# EAGLE schematic PolyDAC2 (EAGLE 5.11)

## Sheet 1 of 8
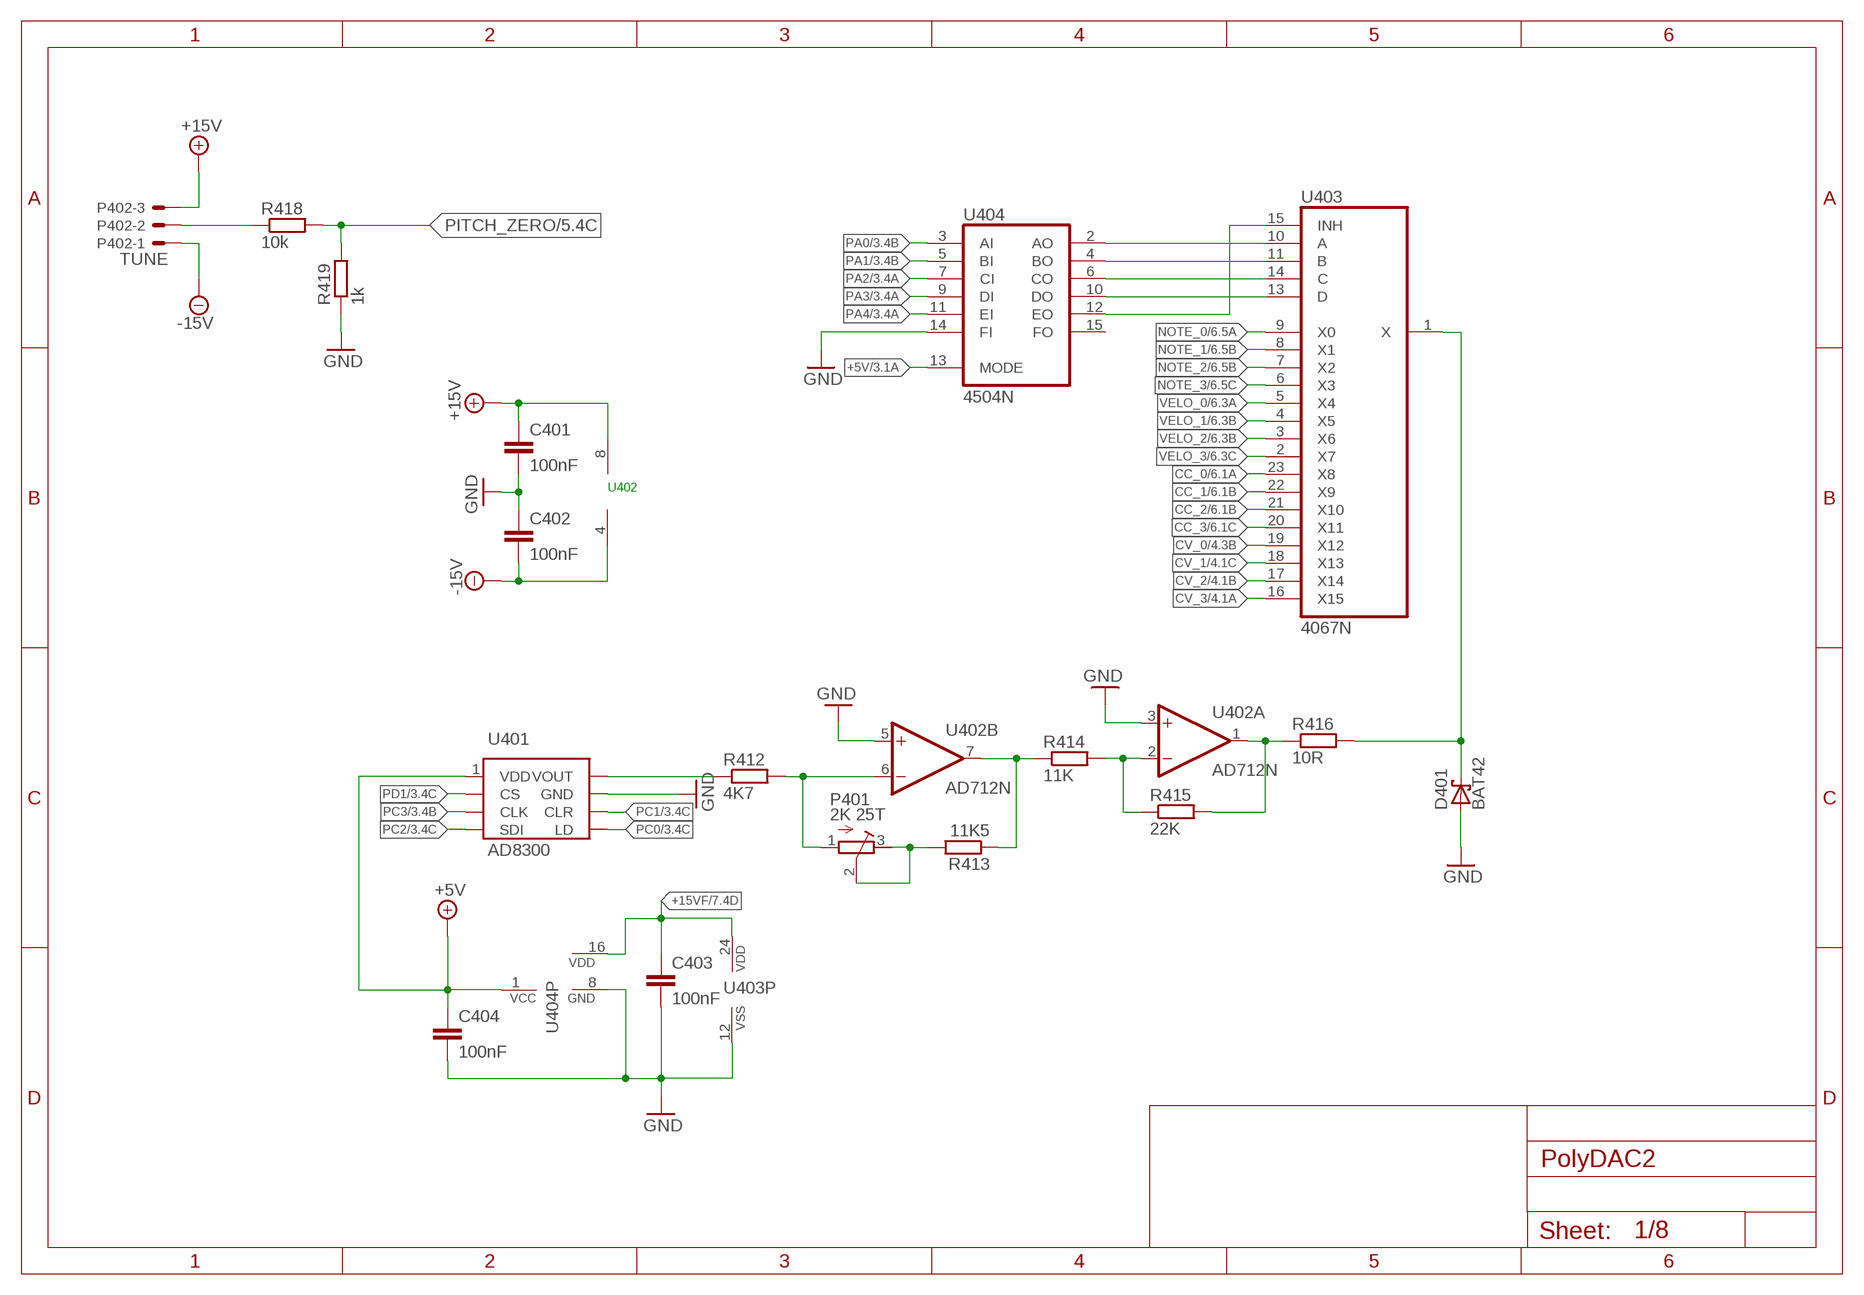
[diagram p0: schematic, sheet 1]

### Parts
C401  100nF  C-EU025-025X050  [C025-025X050]
C402  100nF  C-EU025-025X050  [C025-025X050]
C403  100nF  C-EU025-025X050  [C025-025X050]
C404  100nF  C-EU025-025X050  [C025-025X050]
D401  BAT42  [DO35-10]
P401  2K 25T  R-TRIMM64Y  [RTRIM64Y]
P402  TUNE  22-23-2031  [22-23-2031]
R412  4K7  R-EU_0207/10  [0207/10]
R413  11K5  R-EU_0207/10  [0207/10]
R414  11K  R-EU_0207/10  [0207/10]
R415  22K  R-EU_0207/10  [0207/10]
R416  10R  R-EU_0207/10  [0207/10]
R418  10k  R-EU_0207/10  [0207/10]
R419  1k  R-EU_0207/10  [0207/10]
U401  AD8300  [DIL08]
U402  AD712N  [DIL08]
U403  4067N  [DIL24-6]
U404  4504N  [DIL16]

### Nets
+5V [bold]: C404.1 U401.1(VDD) U404.1(VCC) U404.13(MODE) ; also sheet 2,3,7,8
+15V [bold]: C401.1 P402.3 U402.8(P:V+) ; also sheet 4,5,6,7,8
+15VF [bold]: C403.1 U403.24(VDD) U404.16(VDD) ; also sheet 7
-15V: C402.2 P402.1 U402.4(P:V-) ; also sheet 4,5,6,7
CC_0: U403.23(X8) ; also sheet 6
CC_1: U403.22(X9) ; also sheet 6
CC_2: U403.21(X10) ; also sheet 6
CC_3: U403.20(X11) ; also sheet 6
CV_0: U403.19(X12) ; also sheet 4
CV_1: U403.18(X13) ; also sheet 4
CV_2: U403.17(X14) ; also sheet 4
CV_3: U403.16(X15) ; also sheet 4
GND [bold]: C401.2 C402.1 C403.2 C404.2 D401.A R419.1 U401.7(GND) U402.3(A:+IN) U402.5(B:+IN) U403.12(VSS) U404.8(GND) U404.14(FI) ; also sheet 2,3,4,5,6,7,8
N$1: P402.2 R418.1
N$2: U403.10(A) U404.2(AO)
N$3: U403.11(B) U404.4(BO)
N$4: U403.14(C) U404.6(CO)
N$5: U403.13(D) U404.10(DO)
N$6: U403.15(INH) U404.12(EO)
N$7: D401.C R416.2 U403.1(X)
N$10: R415.2 R416.1 U402.1(A:OUT)
N$12: R412.1 U401.8(VOUT)
N$13: R414.2 R415.1 U402.2(A:-IN)
N$14: R413.1 R414.1 U402.7(B:OUT)
N$15: P401.2(S) P401.3(A) R413.2
N$17: P401.1(E) R412.2 U402.6(B:-IN)
NOTE_0: U403.9(X0) ; also sheet 6
NOTE_1: U403.8(X1) ; also sheet 6
NOTE_2: U403.7(X2) ; also sheet 6
NOTE_3: U403.6(X3) ; also sheet 6
PA0: U404.3(AI) ; also sheet 3
PA1: U404.5(BI) ; also sheet 3
PA2: U404.7(CI) ; also sheet 3
PA3: U404.9(DI) ; also sheet 3
PA4: U404.11(EI) ; also sheet 3
PC0: U401.5(LD) ; also sheet 3
PC1: U401.6(CLR) ; also sheet 3
PC2: U401.4(SDI) ; also sheet 3
PC3: U401.3(CLK) ; also sheet 3
PD1: U401.2(CS) ; also sheet 3
PITCH_ZERO: R418.2 R419.2 ; also sheet 5
VELO_0: U403.5(X4) ; also sheet 6
VELO_1: U403.4(X5) ; also sheet 6
VELO_2: U403.3(X6) ; also sheet 6
VELO_3: U403.2(X7) ; also sheet 6
Unconnected: U404.15(FO)

### Notes on the sheet
- U402

## Sheet 2 of 8
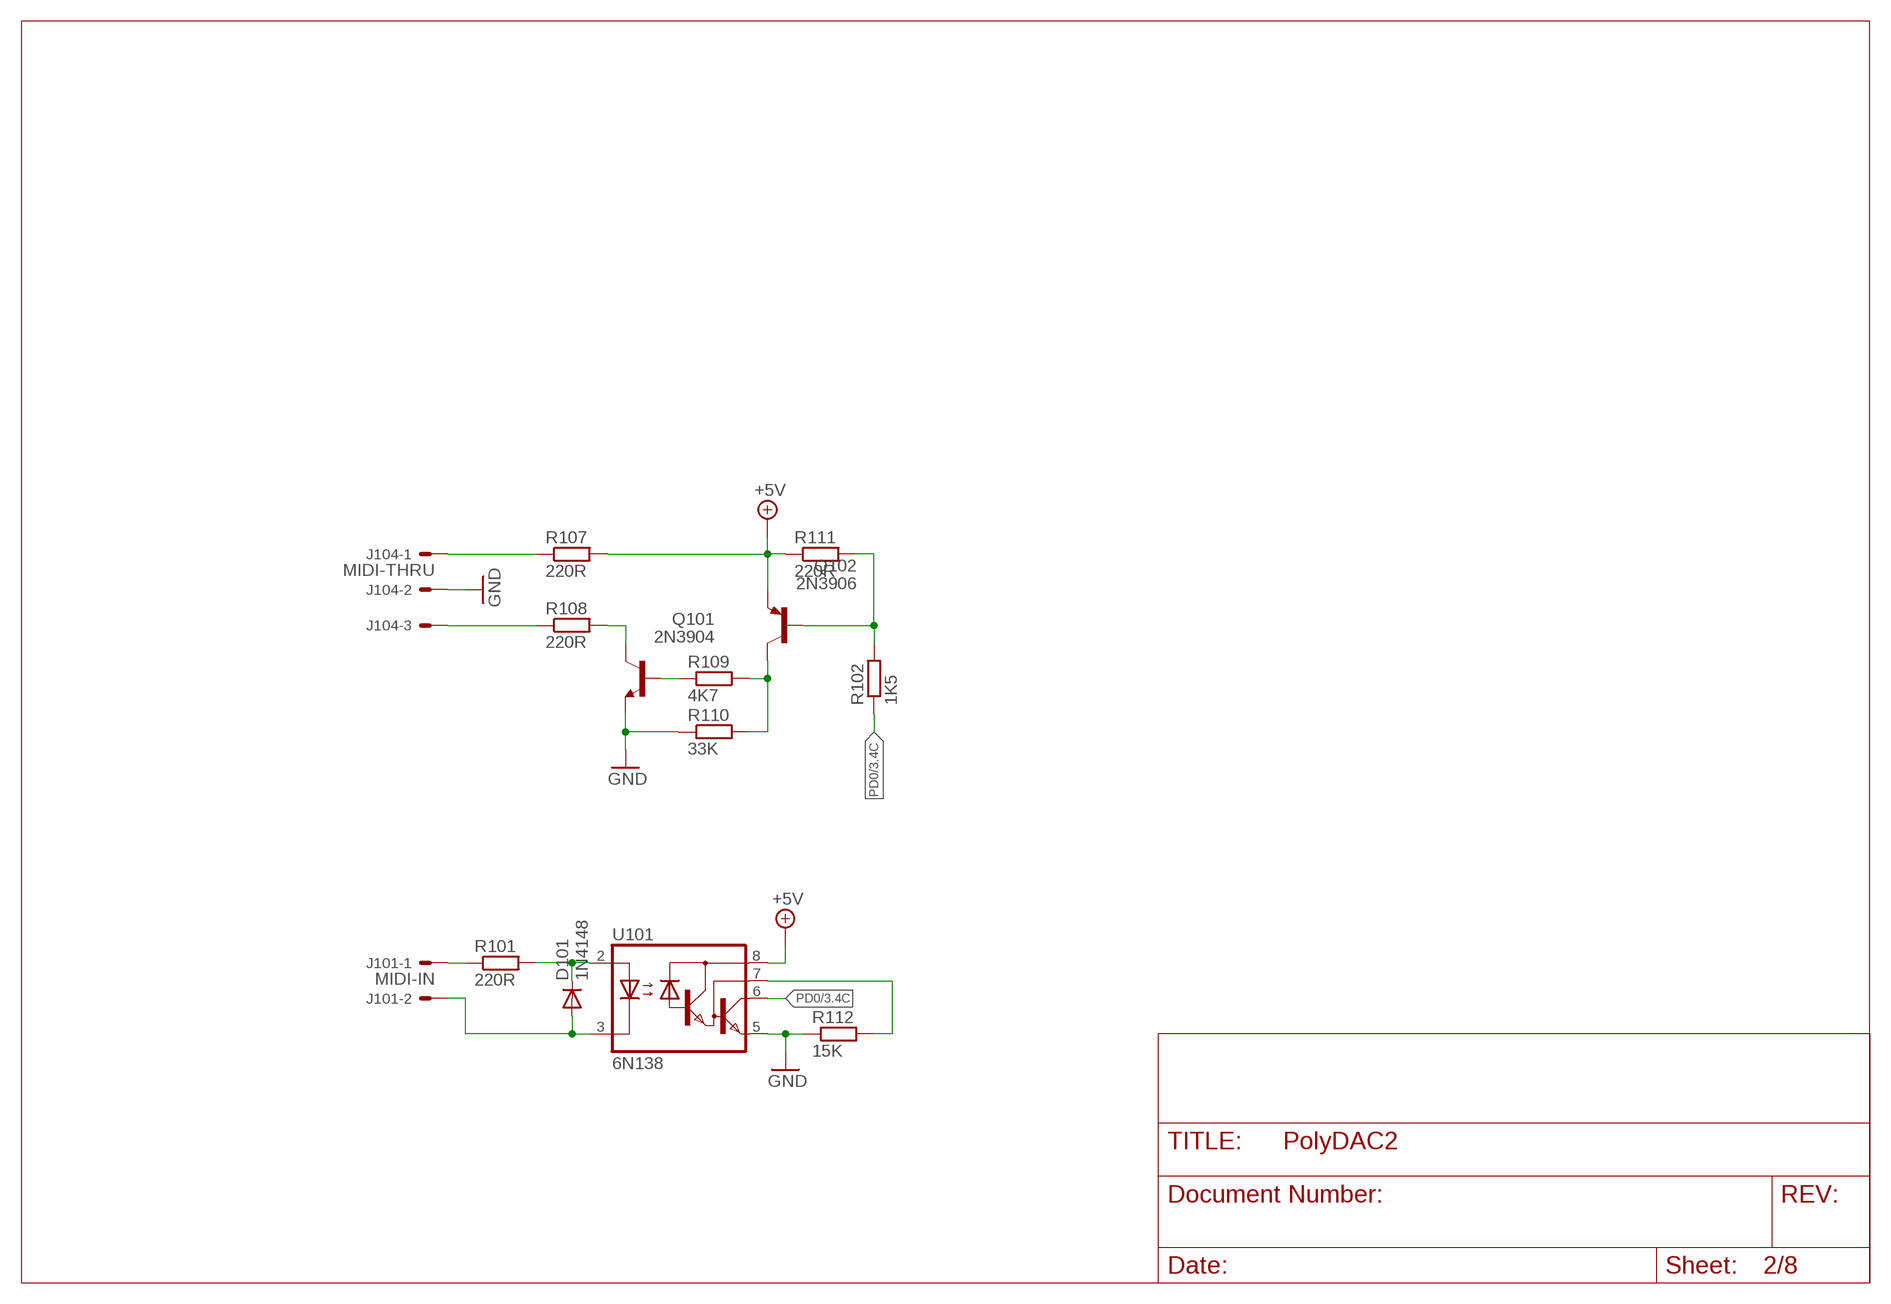
[diagram p1: schematic, sheet 2]

### Parts
D101  1N4148  1N4148DO35-10  [DO35-10]
J101  MIDI-IN  22-23-2021  [22-23-2021]
J104  MIDI-THRU  22-23-2031  [22-23-2031]
Q101  2N3904  [TO92]
Q102  2N3906  2N3906-PNP-TO92-EBC  [TO92-EBC]
R101  220R  R-EU_0207/10  [0207/10]
R102  1K5  R-EU_0207/10  [0207/10]
R107  220R  R-EU_0207/10  [0207/10]
R108  220R  R-EU_0207/10  [0207/10]
R109  4K7  R-EU_0207/10  [0207/10]
R110  33K  R-EU_0207/10  [0207/10]
R111  220R  R-EU_0207/10  [0207/10]
R112  15K  R-EU_0207/10  [0207/10]
U101  6N138  [DIL08]

### Nets
+5V [bold]: Q102.E R107.2 R111.1 U101.8(VCC) ; also sheet 1,3,7,8
GND [bold]: J104.2 Q101.3(E) R110.1 R112.1 U101.5(GND) ; also sheet 1,3,4,5,6,7,8
N$16: J104.1 R107.1
N$19: J104.3 R108.1
N$20: Q101.1(C) R108.2
N$21: Q101.2(B) R109.1
N$22: Q102.C R109.2 R110.2
N$24: D101.C R101.2 U101.2(A)
N$25: Q102.B R102.2 R111.2
N$26: J101.1 R101.1
N$27: D101.A J101.2 U101.3(C)
N$30: R112.2 U101.7(VB)
PD0: R102.1 U101.6(VO) ; also sheet 3

## Sheet 3 of 8
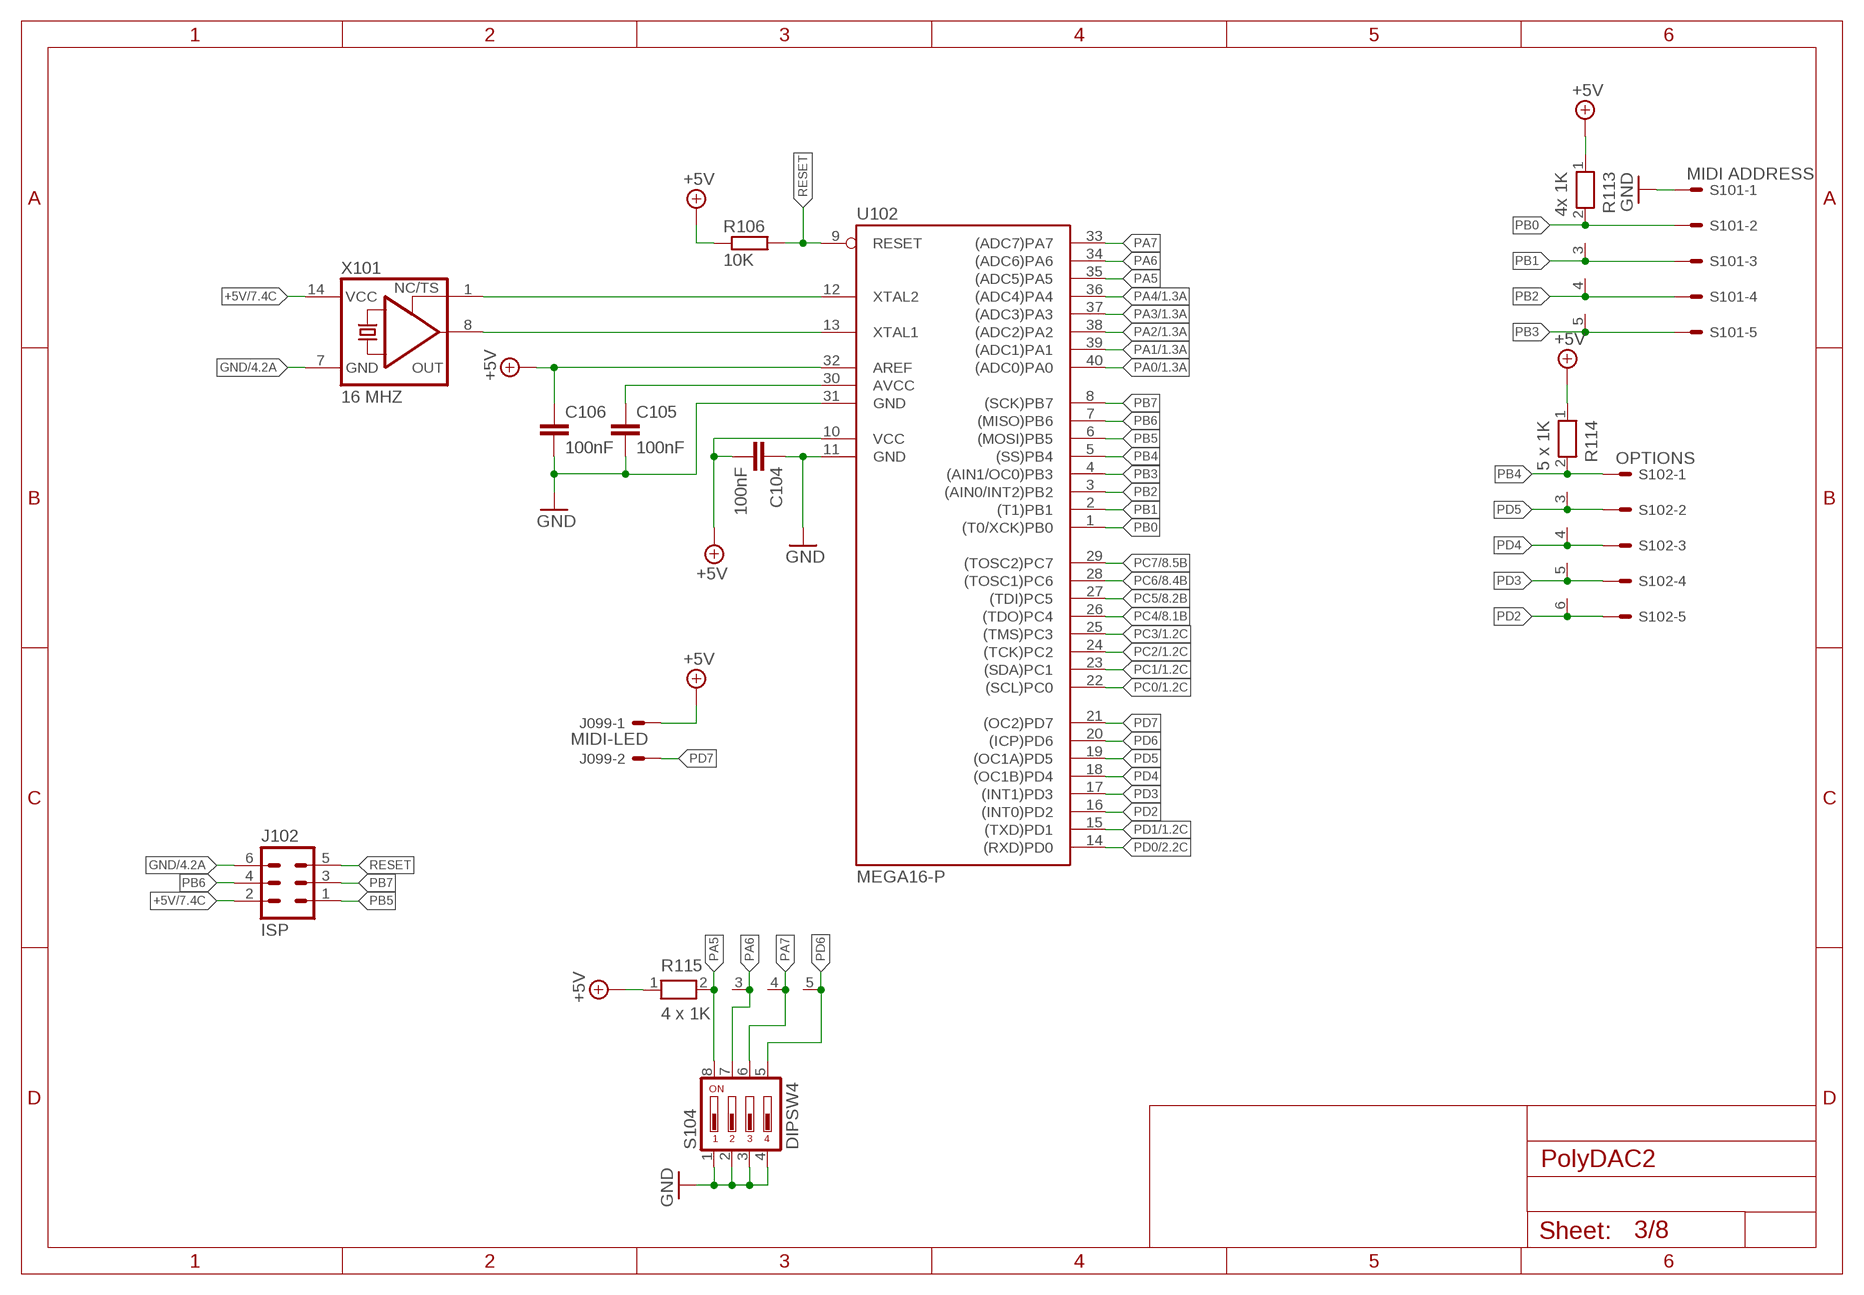
[diagram p2: schematic, sheet 3]

### Parts
C104  100nF  C-EU025-025X050  [C025-025X050]
C105  100nF  C-EU025-025X050  [C025-025X050]
C106  100nF  C-EU025-025X050  [C025-025X050]
J099  MIDI-LED  22-23-2021  [22-23-2021]
J102  ISP  ML6  [ML6]
R106  10K  R-EU_0207/10  [0207/10]
R113  4x 1K  RN04  [RN-5]
R114  5 x 1K  RN05  [RN-6]
R115  4 x 1K  RN04  [RN-5]
S101  MIDI ADDRESS  22-23-2051  [22-23-2051]
S102  OPTIONS  22-23-2051  [22-23-2051]
S104  DIPSW4  DP04  [DP-04]
U102  MEGA16-P  [DIL40]
X101  16 MHZ  XO-14  [DIL14S]

### Nets
+5V [bold]: C104.2 C106.1 J099.1 J102.2 R106.1 R113.1 R114.1 R115.1 U102.10(VCC) U102.32(AREF) X101.14(VCC) ; also sheet 1,2,7,8
GND [bold]: C104.1 C105.2 C106.2 J102.6 S101.1 S104.1 S104.2 S104.3 S104.4 U102.11(GND) U102.31(GND) X101.7(GND) ; also sheet 1,2,4,5,6,7,8
N$28: U102.13(XTAL1) X101.8(OUT)
N$29: U102.12(XTAL2) X101.1(TS)
N$32: C105.1 U102.30(AVCC)
PA0: U102.40((ADC0)PA0) ; also sheet 1
PA1: U102.39((ADC1)PA1) ; also sheet 1
PA2: U102.38((ADC2)PA2) ; also sheet 1
PA3: U102.37((ADC3)PA3) ; also sheet 1
PA4: U102.36((ADC4)PA4) ; also sheet 1
PA5: R115.2 S104.8 U102.35((ADC5)PA5)
PA6: R115.3 S104.7 U102.34((ADC6)PA6)
PA7: R115.4 S104.6 U102.33((ADC7)PA7)
PB0: R113.2 S101.2 U102.1((T0/XCK)PB0)
PB1: R113.3 S101.3 U102.2((T1)PB1)
PB2: R113.4 S101.4 U102.3((AIN0/INT2)PB2)
PB3: R113.5 S101.5 U102.4((AIN1/OC0)PB3)
PB4: R114.2 S102.1 U102.5((SS)PB4)
PB5: J102.1 U102.6((MOSI)PB5)
PB6: J102.4 U102.7((MISO)PB6)
PB7: J102.3 U102.8((SCK)PB7)
PC0: U102.22((SCL)PC0) ; also sheet 1
PC1: U102.23((SDA)PC1) ; also sheet 1
PC2: U102.24((TCK)PC2) ; also sheet 1
PC3: U102.25((TMS)PC3) ; also sheet 1
PC4: U102.26((TDO)PC4) ; also sheet 8
PC5: U102.27((TDI)PC5) ; also sheet 8
PC6: U102.28((TOSC1)PC6) ; also sheet 8
PC7: U102.29((TOSC2)PC7) ; also sheet 8
PD0: U102.14((RXD)PD0) ; also sheet 2
PD1: U102.15((TXD)PD1) ; also sheet 1
PD2: R114.6 S102.5 U102.16((INT0)PD2)
PD3: R114.5 S102.4 U102.17((INT1)PD3)
PD4: R114.4 S102.3 U102.18((OC1B)PD4)
PD5: R114.3 S102.2 U102.19((OC1A)PD5)
PD6: R115.5 S104.5 U102.20((ICP)PD6)
PD7: J099.2 U102.21((OC2)PD7)
RESET: J102.5 R106.2 U102.9(RESET)

## Sheet 4 of 8
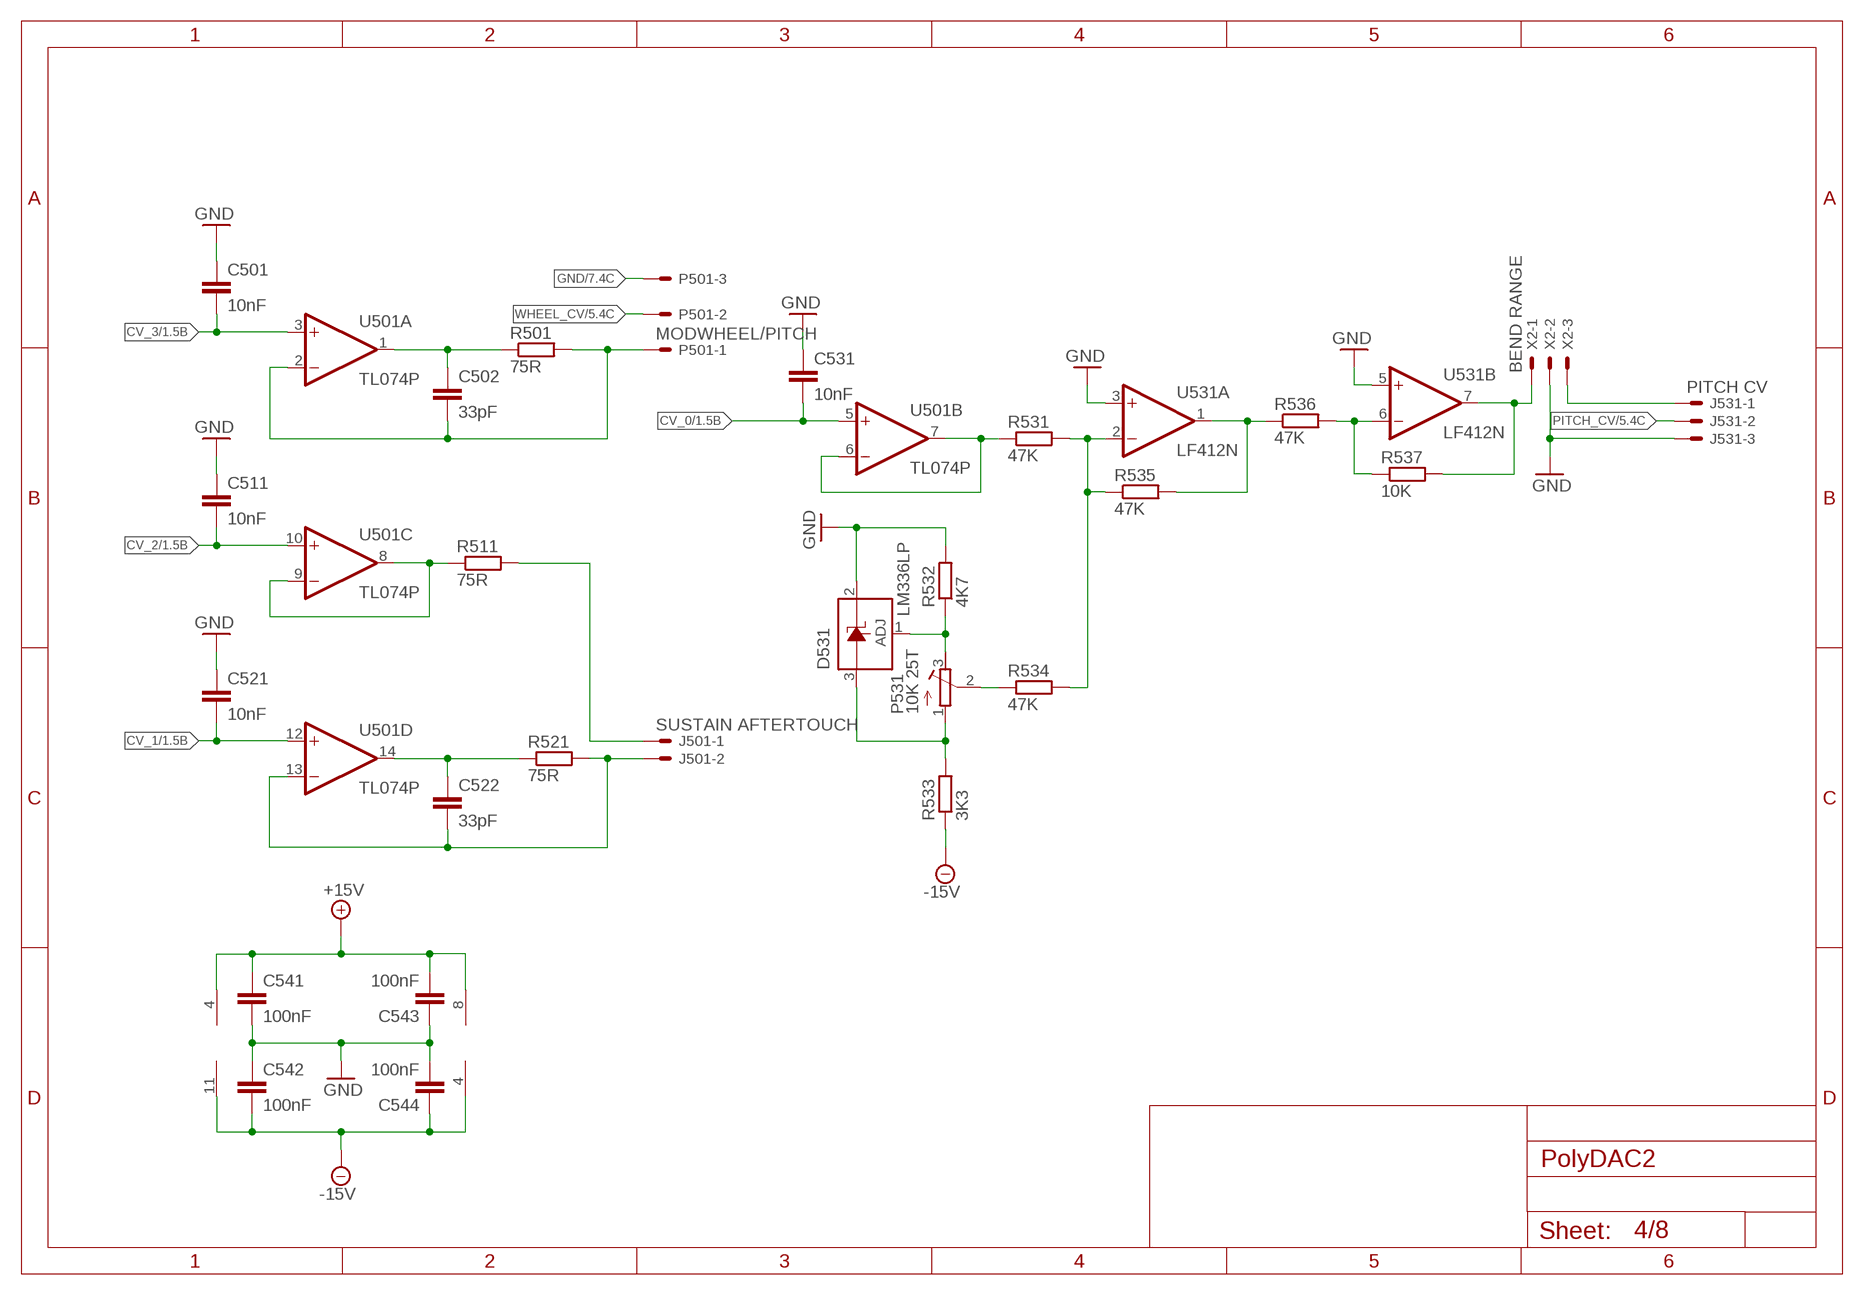
[diagram p3: schematic, sheet 4]

### Parts
C501  10nF  C-EU025-025X050  [C025-025X050]
C502  33pF  C-EU025-025X050  [C025-025X050]
C511  10nF  C-EU025-025X050  [C025-025X050]
C521  10nF  C-EU025-025X050  [C025-025X050]
C522  33pF  C-EU025-025X050  [C025-025X050]
C531  10nF  C-EU025-025X050  [C025-025X050]
C541  100nF  C-EU025-025X050  [C025-025X050]
C542  100nF  C-EU025-025X050  [C025-025X050]
C543  100nF  C-EU025-025X050  [C025-025X050]
C544  100nF  C-EU025-025X050  [C025-025X050]
D531  LM336LP  [TO92]
J501  SUSTAIN AFTERTOUCH  22-23-2021  [22-23-2021]
J531  PITCH CV  22-23-2031  [22-23-2031]
P501  MODWHEEL/PITCH  22-23-2031  [22-23-2031]
P531  10K 25T  R-TRIMM64Y  [RTRIM64Y]
R501  75R  R-EU_0207/10  [0207/10]
R511  75R  R-EU_0207/10  [0207/10]
R521  75R  R-EU_0207/10  [0207/10]
R531  47K  R-EU_0207/10  [0207/10]
R532  4K7  R-EU_0207/10  [0207/10]
R533  3K3  R-EU_0207/10  [0207/10]
R534  47K  R-EU_0207/10  [0207/10]
R535  47K  R-EU_0207/10  [0207/10]
R536  47K  R-EU_0207/10  [0207/10]
R537  10K  R-EU_0207/10  [0207/10]
U501  TL074P  [DIL14]
U531  LF412N  [DIL08]
X2  BEND RANGE  22-23-2031  [22-23-2031]

### Nets
+15V [bold]: C541.1 C543.2 U501.4(P:V+) U531.8(P:V+) ; also sheet 1,5,6,7,8
-15V: C542.2 C544.1 R533.1 U501.11(P:V-) U531.4(P:V-) ; also sheet 1,5,6,7
CV_0: C531.2 U501.5(B:+IN) ; also sheet 1
CV_1: C521.2 U501.12(D:+IN) ; also sheet 1
CV_2: C511.2 U501.10(C:+IN) ; also sheet 1
CV_3: C501.2 U501.3(A:+IN) ; also sheet 1
GND [bold]: C501.1 C511.1 C521.1 C531.1 C541.2 C542.1 C543.1 C544.2 D531.2(C) J531.3 P501.3 R532.2 U531.3(A:+IN) U531.5(B:+IN) X2.2 ; also sheet 1,2,3,5,6,7,8
N$31: C502.2 P501.1 R501.2 U501.2(A:-IN)
N$33: C502.1 R501.1 U501.1(A:OUT)
N$35: R511.1 U501.8(C:OUT) U501.9(C:-IN)
N$36: C522.1 R521.1 U501.14(D:OUT)
N$37: C522.2 J501.2 R521.2 U501.13(D:-IN)
N$38: J501.1 R511.2
N$39: R531.1 U501.6(B:-IN) U501.7(B:OUT)
N$40: D531.1(ADJ) P531.3(A) R532.1
N$41: P531.2(S) R534.1
N$42: D531.3(A) P531.1(E) R533.2
N$43: R531.2 R534.2 R535.1 U531.2(A:-IN)
N$44: R535.2 R536.1 U531.1(A:OUT)
N$46: R536.2 R537.1 U531.6(B:-IN)
N$48: R537.2 U531.7(B:OUT) X2.1
N$50: J531.1 X2.3
PITCH_CV: J531.2 ; also sheet 5
WHEEL_CV: P501.2 ; also sheet 5

## Sheet 5 of 8
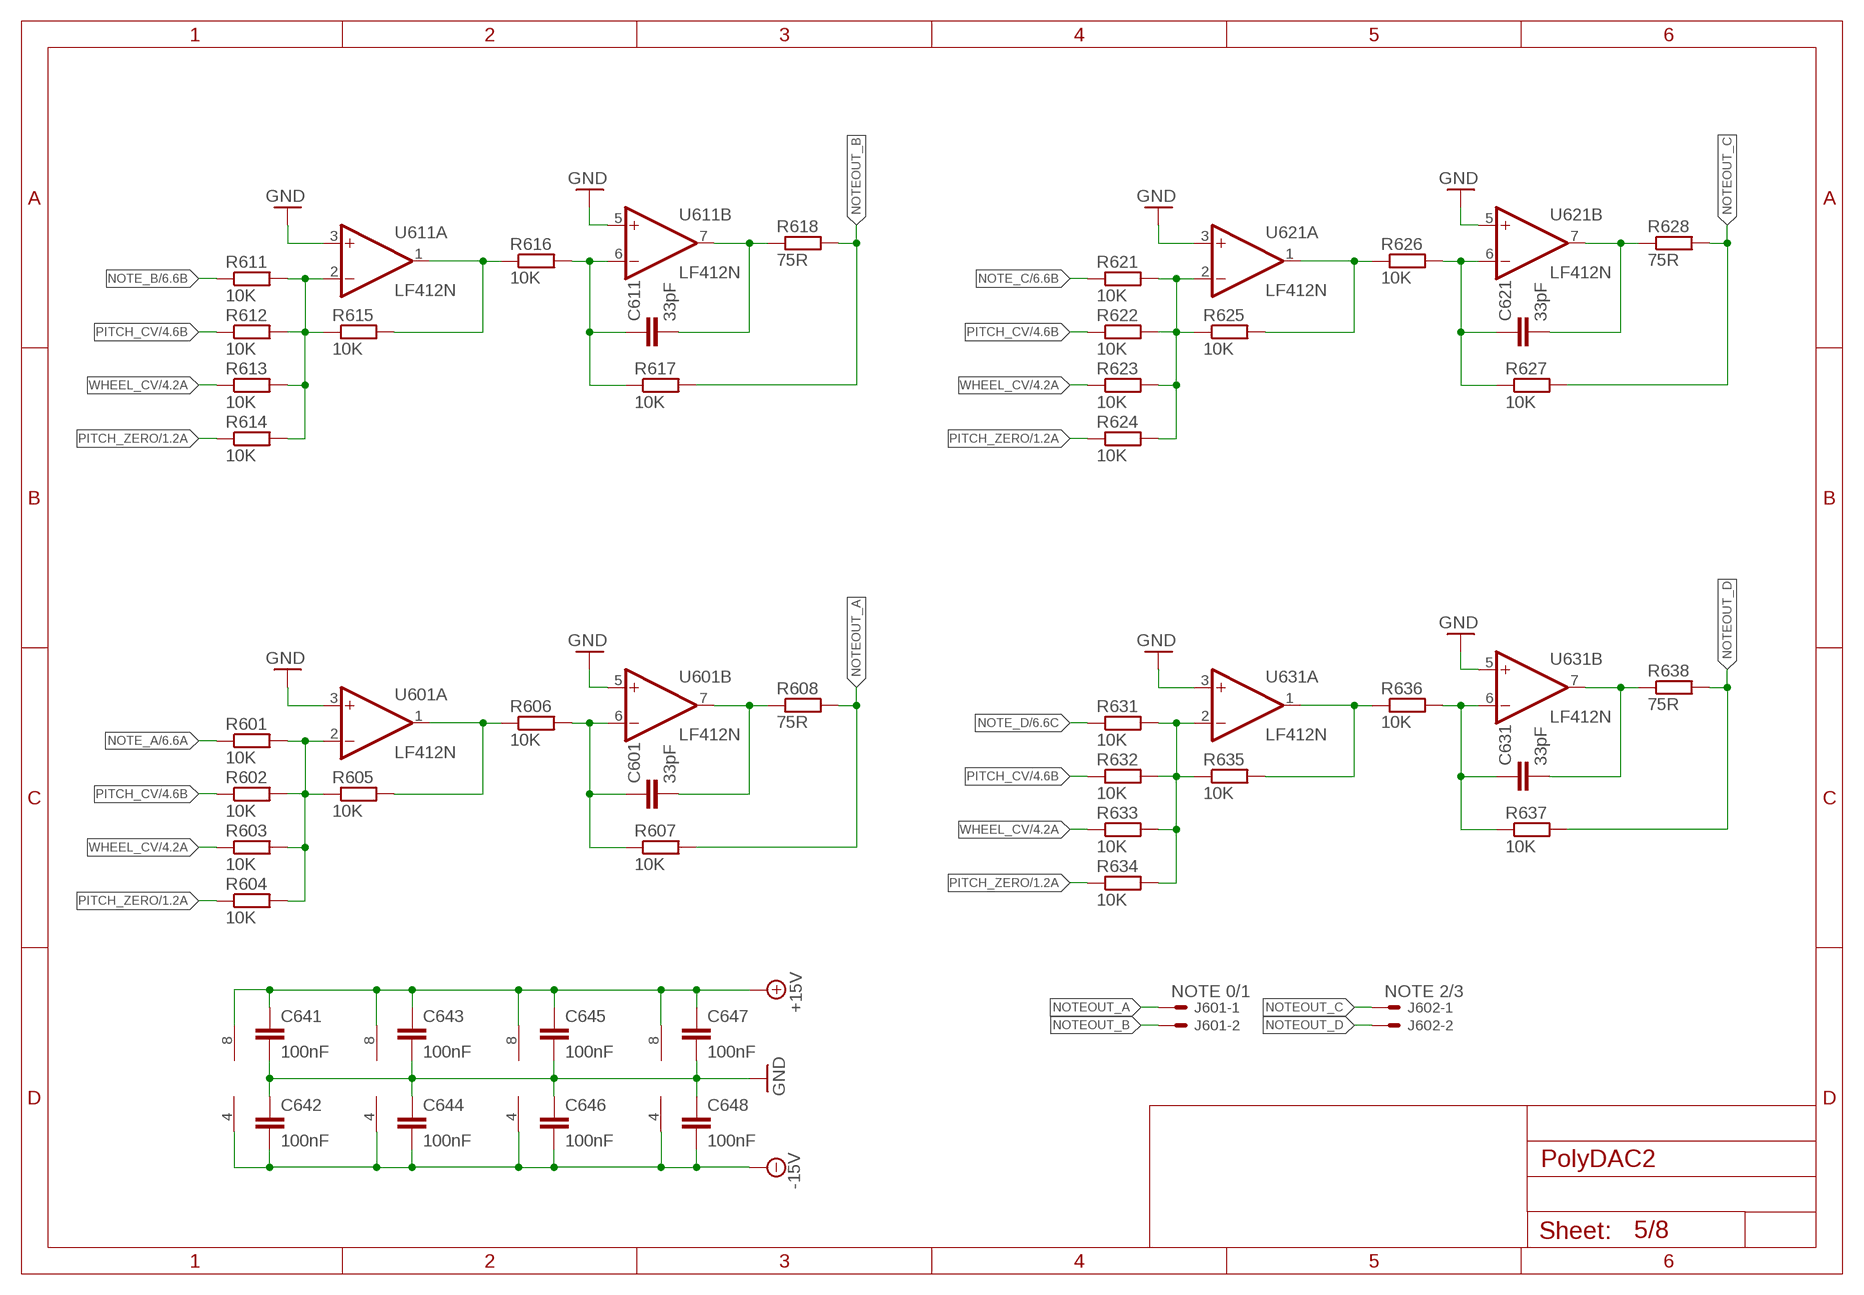
[diagram p4: schematic, sheet 5]

### Parts
C601  33pF  C-EU025-025X050  [C025-025X050]
C611  33pF  C-EU025-025X050  [C025-025X050]
C621  33pF  C-EU025-025X050  [C025-025X050]
C631  33pF  C-EU025-025X050  [C025-025X050]
C641  100nF  C-EU025-025X050  [C025-025X050]
C642  100nF  C-EU025-025X050  [C025-025X050]
C643  100nF  C-EU025-025X050  [C025-025X050]
C644  100nF  C-EU025-025X050  [C025-025X050]
C645  100nF  C-EU025-025X050  [C025-025X050]
C646  100nF  C-EU025-025X050  [C025-025X050]
C647  100nF  C-EU025-025X050  [C025-025X050]
C648  100nF  C-EU025-025X050  [C025-025X050]
J601  NOTE 0/1  22-23-2021  [22-23-2021]
J602  NOTE 2/3  22-23-2021  [22-23-2021]
R601  10K  R-EU_0207/10  [0207/10]
R602  10K  R-EU_0207/10  [0207/10]
R603  10K  R-EU_0207/10  [0207/10]
R604  10K  R-EU_0207/10  [0207/10]
R605  10K  R-EU_0207/10  [0207/10]
R606  10K  R-EU_0207/10  [0207/10]
R607  10K  R-EU_0207/10  [0207/10]
R608  75R  R-EU_0207/10  [0207/10]
R611  10K  R-EU_0207/10  [0207/10]
R612  10K  R-EU_0207/10  [0207/10]
R613  10K  R-EU_0207/10  [0207/10]
R614  10K  R-EU_0207/10  [0207/10]
R615  10K  R-EU_0207/10  [0207/10]
R616  10K  R-EU_0207/10  [0207/10]
R617  10K  R-EU_0207/10  [0207/10]
R618  75R  R-EU_0207/10  [0207/10]
R621  10K  R-EU_0207/10  [0207/10]
R622  10K  R-EU_0207/10  [0207/10]
R623  10K  R-EU_0207/10  [0207/10]
R624  10K  R-EU_0207/10  [0207/10]
R625  10K  R-EU_0207/10  [0207/10]
R626  10K  R-EU_0207/10  [0207/10]
R627  10K  R-EU_0207/10  [0207/10]
R628  75R  R-EU_0207/10  [0207/10]
R631  10K  R-EU_0207/10  [0207/10]
R632  10K  R-EU_0207/10  [0207/10]
R633  10K  R-EU_0207/10  [0207/10]
R634  10K  R-EU_0207/10  [0207/10]
R635  10K  R-EU_0207/10  [0207/10]
R636  10K  R-EU_0207/10  [0207/10]
R637  10K  R-EU_0207/10  [0207/10]
R638  75R  R-EU_0207/10  [0207/10]
U601  LF412N  [DIL08]
U611  LF412N  [DIL08]
U621  LF412N  [DIL08]
U631  LF412N  [DIL08]

### Nets
+15V [bold]: C641.1 C643.1 C645.1 C647.1 U601.8(P:V+) U611.8(P:V+) U621.8(P:V+) U631.8(P:V+) ; also sheet 1,4,6,7,8
-15V: C642.2 C644.2 C646.2 C648.2 U601.4(P:V-) U611.4(P:V-) U621.4(P:V-) U631.4(P:V-) ; also sheet 1,4,6,7
GND [bold]: C641.2 C642.1 C643.2 C644.1 C645.2 C646.1 C647.2 C648.1 U601.3(A:+IN) U601.5(B:+IN) U611.3(A:+IN) U611.5(B:+IN) U621.3(A:+IN) U621.5(B:+IN) U631.3(A:+IN) U631.5(B:+IN) ; also sheet 1,2,3,4,6,7,8
N$51: R601.2 R602.2 R603.2 R604.2 R605.1 U601.2(A:-IN)
N$52: R605.2 R606.1 U601.1(A:OUT)
N$53: R611.2 R612.2 R613.2 R614.2 R615.1 U611.2(A:-IN)
N$54: C601.1 R606.2 R607.1 U601.6(B:-IN)
N$55: C611.1 R616.2 R617.1 U611.6(B:-IN)
N$56: R615.2 R616.1 U611.1(A:OUT)
N$57: C611.2 R618.1 U611.7(B:OUT)
N$58: C601.2 R608.1 U601.7(B:OUT)
N$61: R621.2 R622.2 R623.2 R624.2 R625.1 U621.2(A:-IN)
N$63: R625.2 R626.1 U621.1(A:OUT)
N$64: C621.1 R626.2 R627.1 U621.6(B:-IN)
N$65: C621.2 R628.1 U621.7(B:OUT)
N$68: R631.2 R632.2 R633.2 R634.2 R635.1 U631.2(A:-IN)
N$69: R635.2 R636.1 U631.1(A:OUT)
N$70: C631.1 R636.2 R637.1 U631.6(B:-IN)
N$71: C631.2 R638.1 U631.7(B:OUT)
NOTE_A: R601.1 ; also sheet 6
NOTE_B: R611.1 ; also sheet 6
NOTE_C: R621.1 ; also sheet 6
NOTE_D: R631.1 ; also sheet 6
NOTEOUT_A: J601.1 R607.2 R608.2
NOTEOUT_B: J601.2 R617.2 R618.2
NOTEOUT_C: J602.1 R627.2 R628.2
NOTEOUT_D: J602.2 R637.2 R638.2
PITCH_CV: R602.1 R612.1 R622.1 R632.1 ; also sheet 4
PITCH_ZERO: R604.1 R614.1 R624.1 R634.1 ; also sheet 1
WHEEL_CV: R603.1 R613.1 R623.1 R633.1 ; also sheet 4

## Sheet 6 of 8
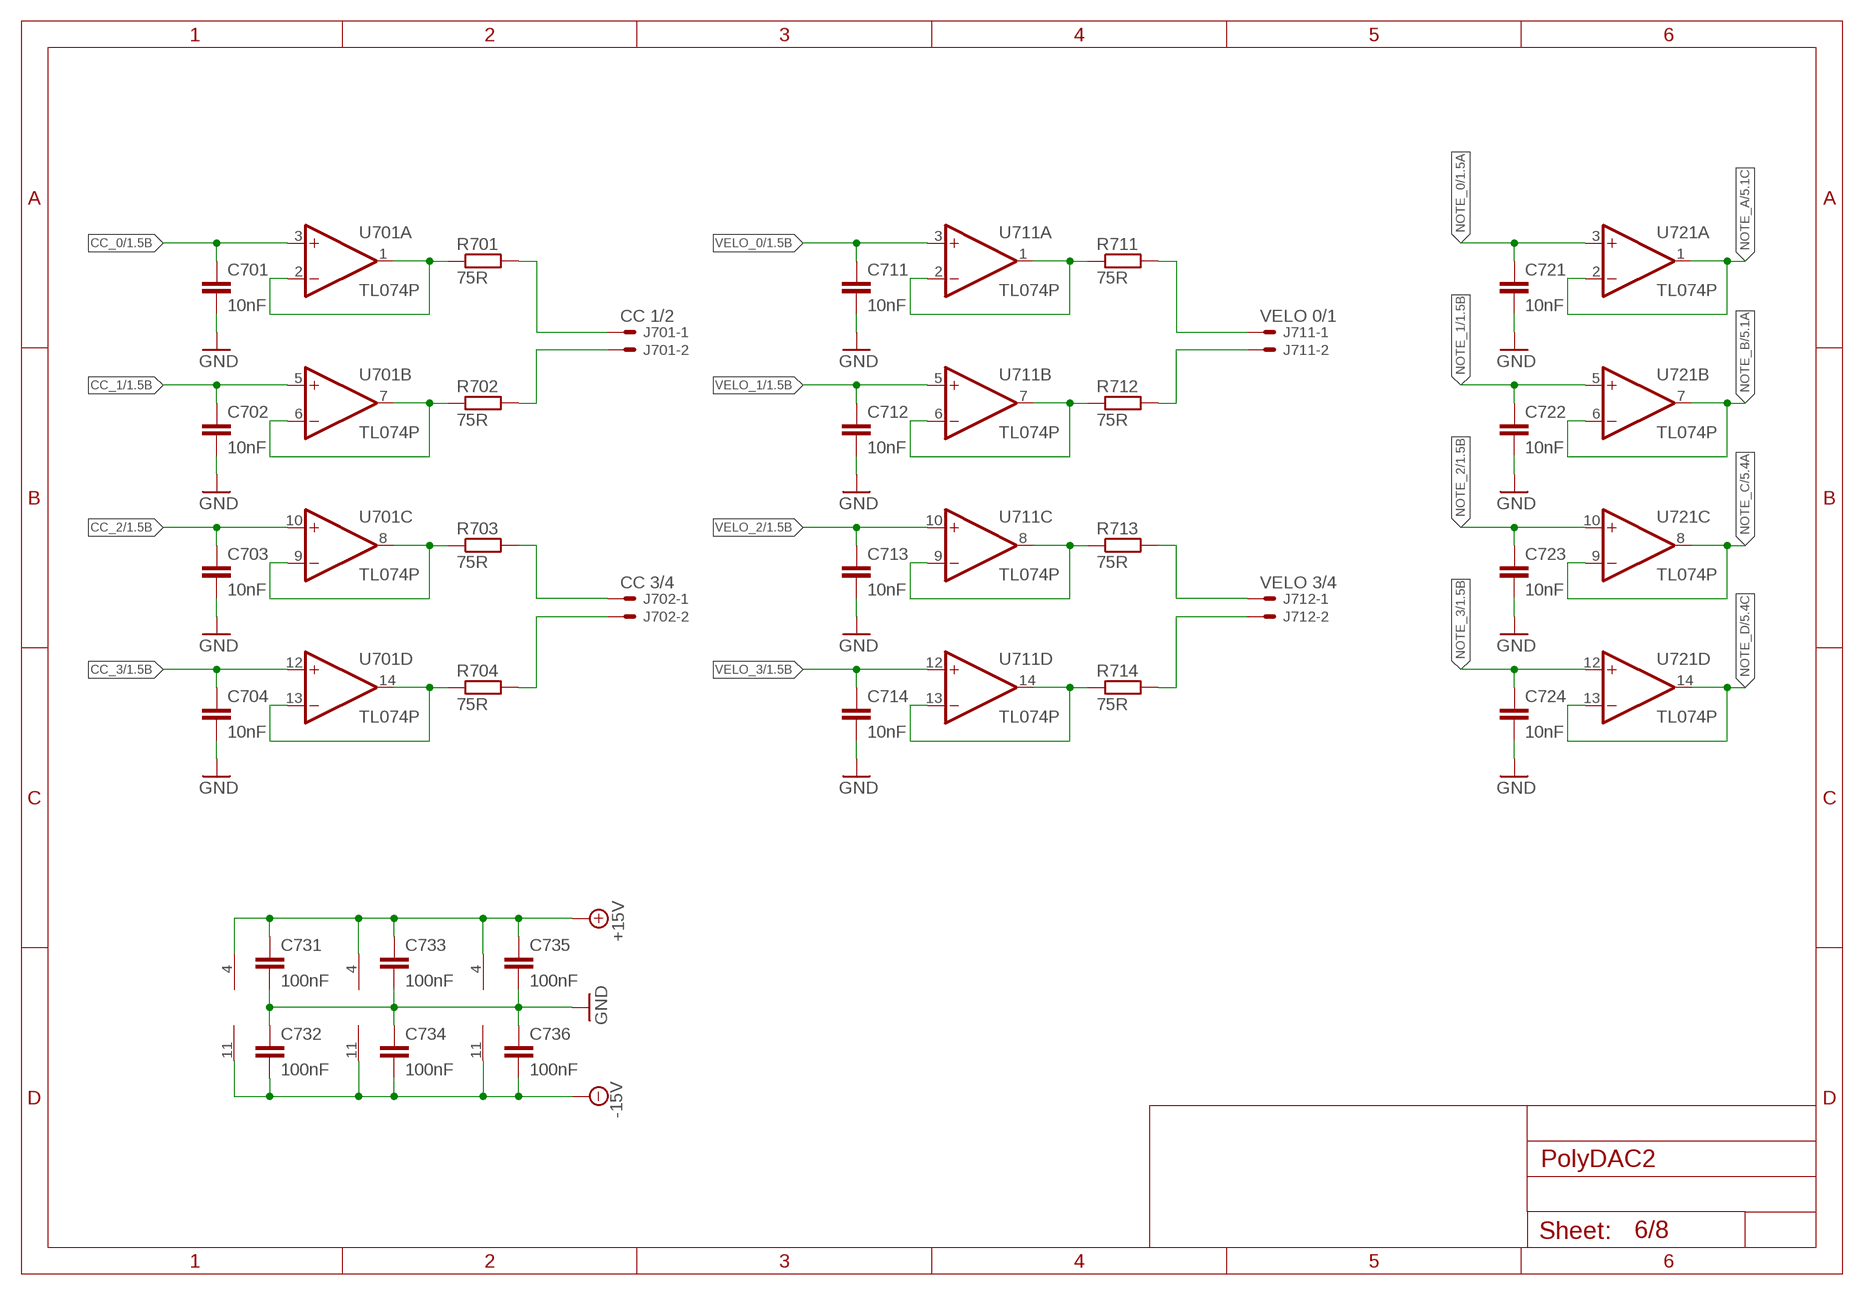
[diagram p5: schematic, sheet 6]

### Parts
C701  10nF  C-EU025-025X050  [C025-025X050]
C702  10nF  C-EU025-025X050  [C025-025X050]
C703  10nF  C-EU025-025X050  [C025-025X050]
C704  10nF  C-EU025-025X050  [C025-025X050]
C711  10nF  C-EU025-025X050  [C025-025X050]
C712  10nF  C-EU025-025X050  [C025-025X050]
C713  10nF  C-EU025-025X050  [C025-025X050]
C714  10nF  C-EU025-025X050  [C025-025X050]
C721  10nF  C-EU025-025X050  [C025-025X050]
C722  10nF  C-EU025-025X050  [C025-025X050]
C723  10nF  C-EU025-025X050  [C025-025X050]
C724  10nF  C-EU025-025X050  [C025-025X050]
C731  100nF  C-EU025-025X050  [C025-025X050]
C732  100nF  C-EU025-025X050  [C025-025X050]
C733  100nF  C-EU025-025X050  [C025-025X050]
C734  100nF  C-EU025-025X050  [C025-025X050]
C735  100nF  C-EU025-025X050  [C025-025X050]
C736  100nF  C-EU025-025X050  [C025-025X050]
J701  CC 1/2  22-23-2021  [22-23-2021]
J702  CC 3/4  22-23-2021  [22-23-2021]
J711  VELO 0/1  22-23-2021  [22-23-2021]
J712  VELO 3/4  22-23-2021  [22-23-2021]
R701  75R  R-EU_0207/10  [0207/10]
R702  75R  R-EU_0207/10  [0207/10]
R703  75R  R-EU_0207/10  [0207/10]
R704  75R  R-EU_0207/10  [0207/10]
R711  75R  R-EU_0207/10  [0207/10]
R712  75R  R-EU_0207/10  [0207/10]
R713  75R  R-EU_0207/10  [0207/10]
R714  75R  R-EU_0207/10  [0207/10]
U701  TL074P  [DIL14]
U711  TL074P  [DIL14]
U721  TL074P  [DIL14]

### Nets
+15V [bold]: C731.1 C733.1 C735.1 U701.4(P:V+) U711.4(P:V+) U721.4(P:V+) ; also sheet 1,4,5,7,8
-15V: C732.2 C734.2 C736.2 U701.11(P:V-) U711.11(P:V-) U721.11(P:V-) ; also sheet 1,4,5,7
CC_0: C701.1 U701.3(A:+IN) ; also sheet 1
CC_1: C702.1 U701.5(B:+IN) ; also sheet 1
CC_2: C703.1 U701.10(C:+IN) ; also sheet 1
CC_3: C704.1 U701.12(D:+IN) ; also sheet 1
GND [bold]: C701.2 C702.2 C703.2 C704.2 C711.2 C712.2 C713.2 C714.2 C721.2 C722.2 C723.2 C724.2 C731.2 C732.1 C733.2 C734.1 C735.2 C736.1 ; also sheet 1,2,3,4,5,7,8
N$59: R701.1 U701.1(A:OUT) U701.2(A:-IN)
N$60: R702.1 U701.6(B:-IN) U701.7(B:OUT)
N$66: R703.1 U701.8(C:OUT) U701.9(C:-IN)
N$72: R704.1 U701.13(D:-IN) U701.14(D:OUT)
N$73: J701.1 R701.2
N$74: J701.2 R702.2
N$75: J702.1 R703.2
N$76: J702.2 R704.2
N$77: R711.1 U711.1(A:OUT) U711.2(A:-IN)
N$78: R712.1 U711.6(B:-IN) U711.7(B:OUT)
N$79: R713.1 U711.8(C:OUT) U711.9(C:-IN)
N$80: R714.1 U711.13(D:-IN) U711.14(D:OUT)
N$81: J711.1 R711.2
N$82: J711.2 R712.2
N$83: J712.1 R713.2
N$84: J712.2 R714.2
NOTE_0: C721.1 U721.3(A:+IN) ; also sheet 1
NOTE_1: C722.1 U721.5(B:+IN) ; also sheet 1
NOTE_2: C723.1 U721.10(C:+IN) ; also sheet 1
NOTE_3: C724.1 U721.12(D:+IN) ; also sheet 1
NOTE_A: U721.1(A:OUT) U721.2(A:-IN) ; also sheet 5
NOTE_B: U721.6(B:-IN) U721.7(B:OUT) ; also sheet 5
NOTE_C: U721.8(C:OUT) U721.9(C:-IN) ; also sheet 5
NOTE_D: U721.13(D:-IN) U721.14(D:OUT) ; also sheet 5
VELO_0: C711.1 U711.3(A:+IN) ; also sheet 1
VELO_1: C712.1 U711.5(B:+IN) ; also sheet 1
VELO_2: C713.1 U711.10(C:+IN) ; also sheet 1
VELO_3: C714.1 U711.12(D:+IN) ; also sheet 1

## Sheet 7 of 8
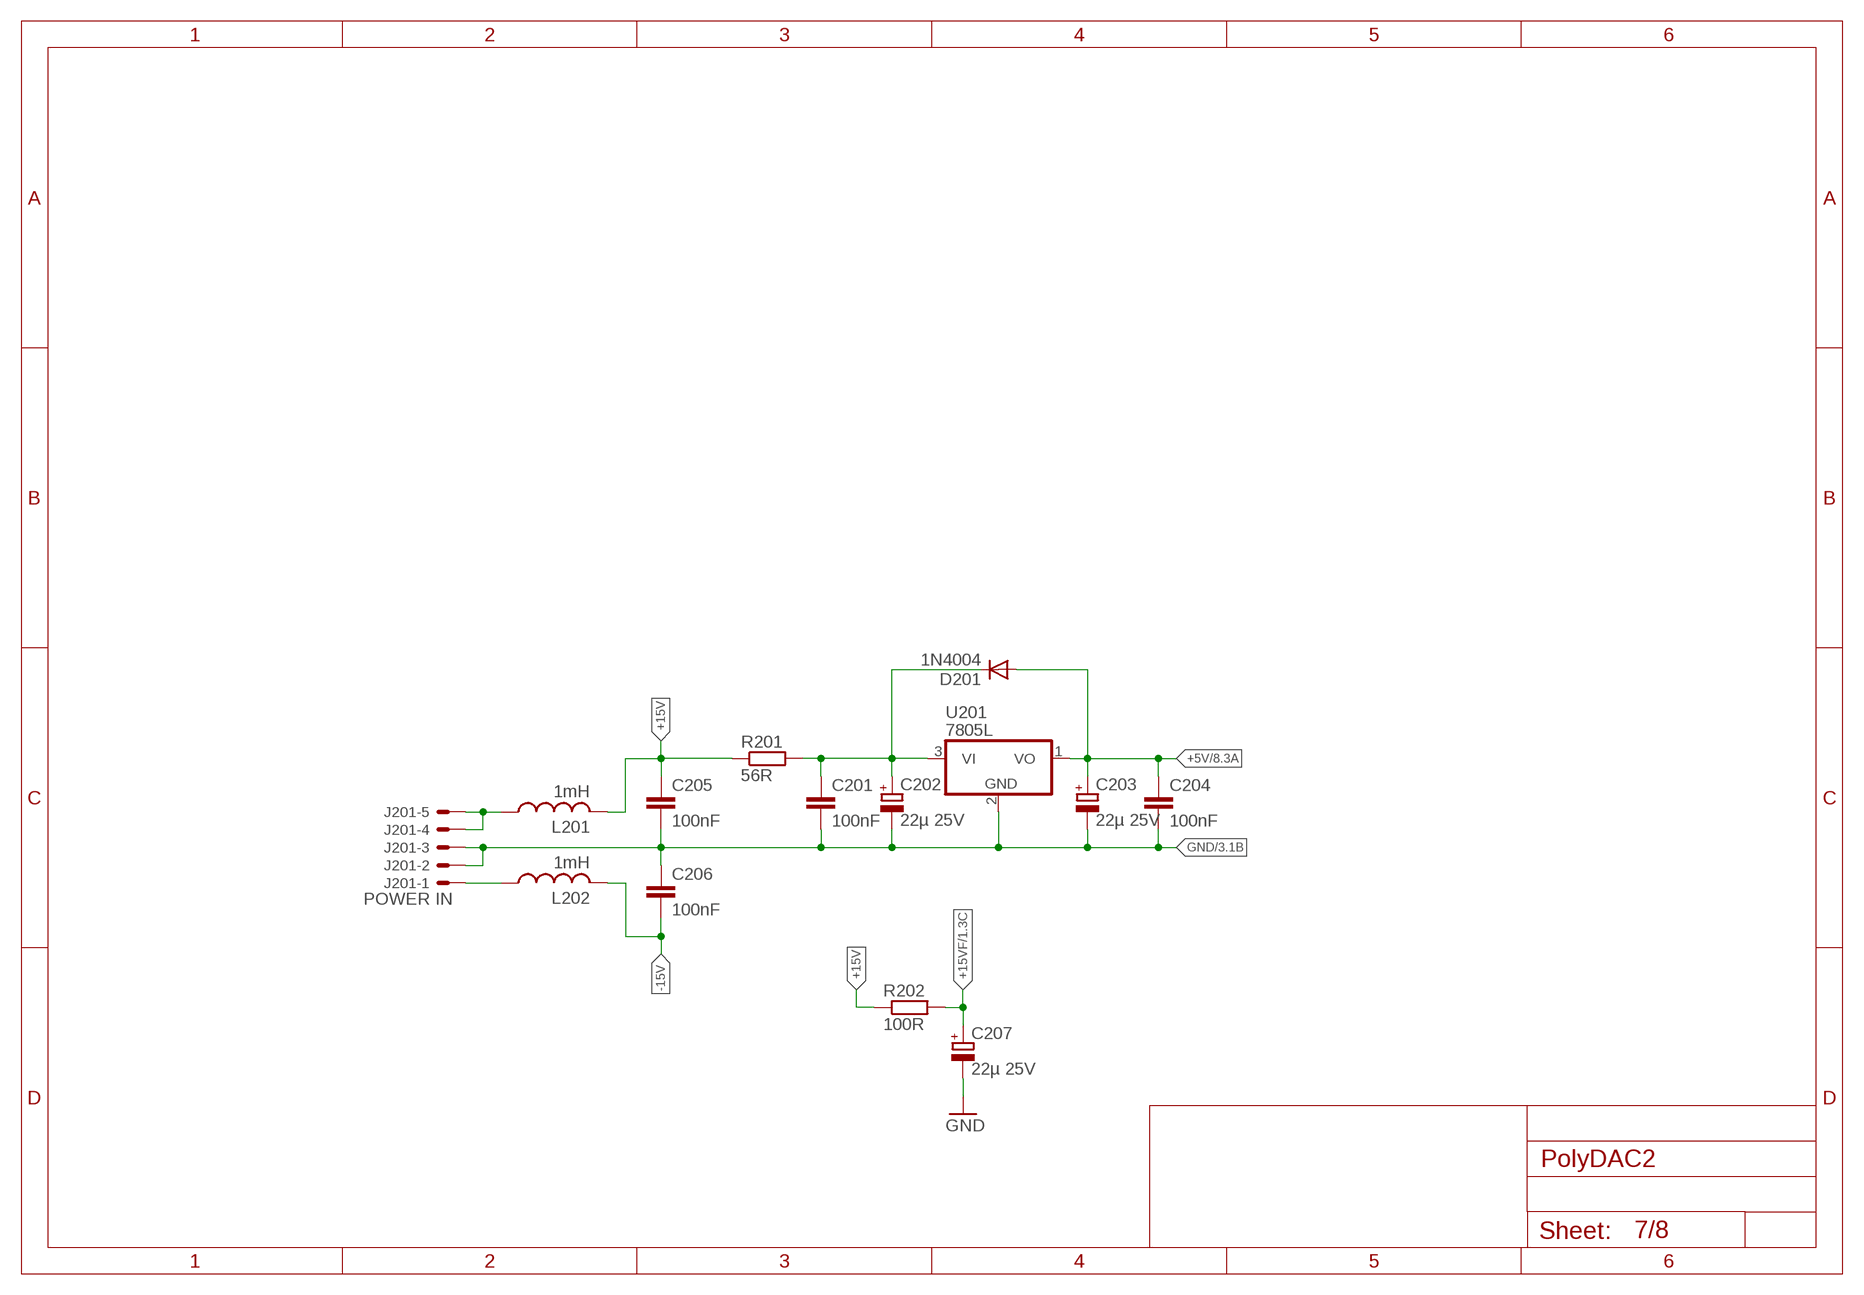
[diagram p6: schematic, sheet 7]

### Parts
C201  100nF  C-EU025-025X050  [C025-025X050]
C202  22µ 25V  CPOL-EUE5-8.5  [E5-8,5]
C203  22µ 25V  CPOL-EUE5-8.5  [E5-8,5]
C204  100nF  C-EU025-025X050  [C025-025X050]
C205  100nF  C-EU025-025X050  [C025-025X050]
C206  100nF  C-EU025-025X050  [C025-025X050]
C207  22µ 25V  CPOL-EUE5-8.5  [E5-8,5]
D201  1N4004  [DO41-10]
J201  POWER IN  22-23-2051  [22-23-2051]
L201  1mH  L-US0207/12  [0207/12]
L202  1mH  L-US0207/12  [0207/12]
R201  56R  R-EU_0207/10  [0207/10]
R202  100R  R-EU_0207/10  [0207/10]
U201  7805L  [TO92]

### Nets
+5V [bold]: C203.+ C204.1 D201.A U201.1(VO) ; also sheet 1,2,3,8
+15V [bold]: C205.1 L201.2 R201.1 R202.1 ; also sheet 1,4,5,6,8
+15VF [bold]: C207.+ R202.2 ; also sheet 1
-15V: C206.2 L202.2 ; also sheet 1,4,5,6
GND [bold]: C201.2 C202.- C203.- C204.2 C205.2 C206.1 C207.- J201.2 J201.3 U201.2(GND) ; also sheet 1,2,3,4,5,6,8
N$86 [bold]: J201.1 L202.1
N$87 [bold]: J201.4 J201.5 L201.1
N$92: C201.1 C202.+ D201.C R201.2 U201.3(VI)

## Sheet 8 of 8
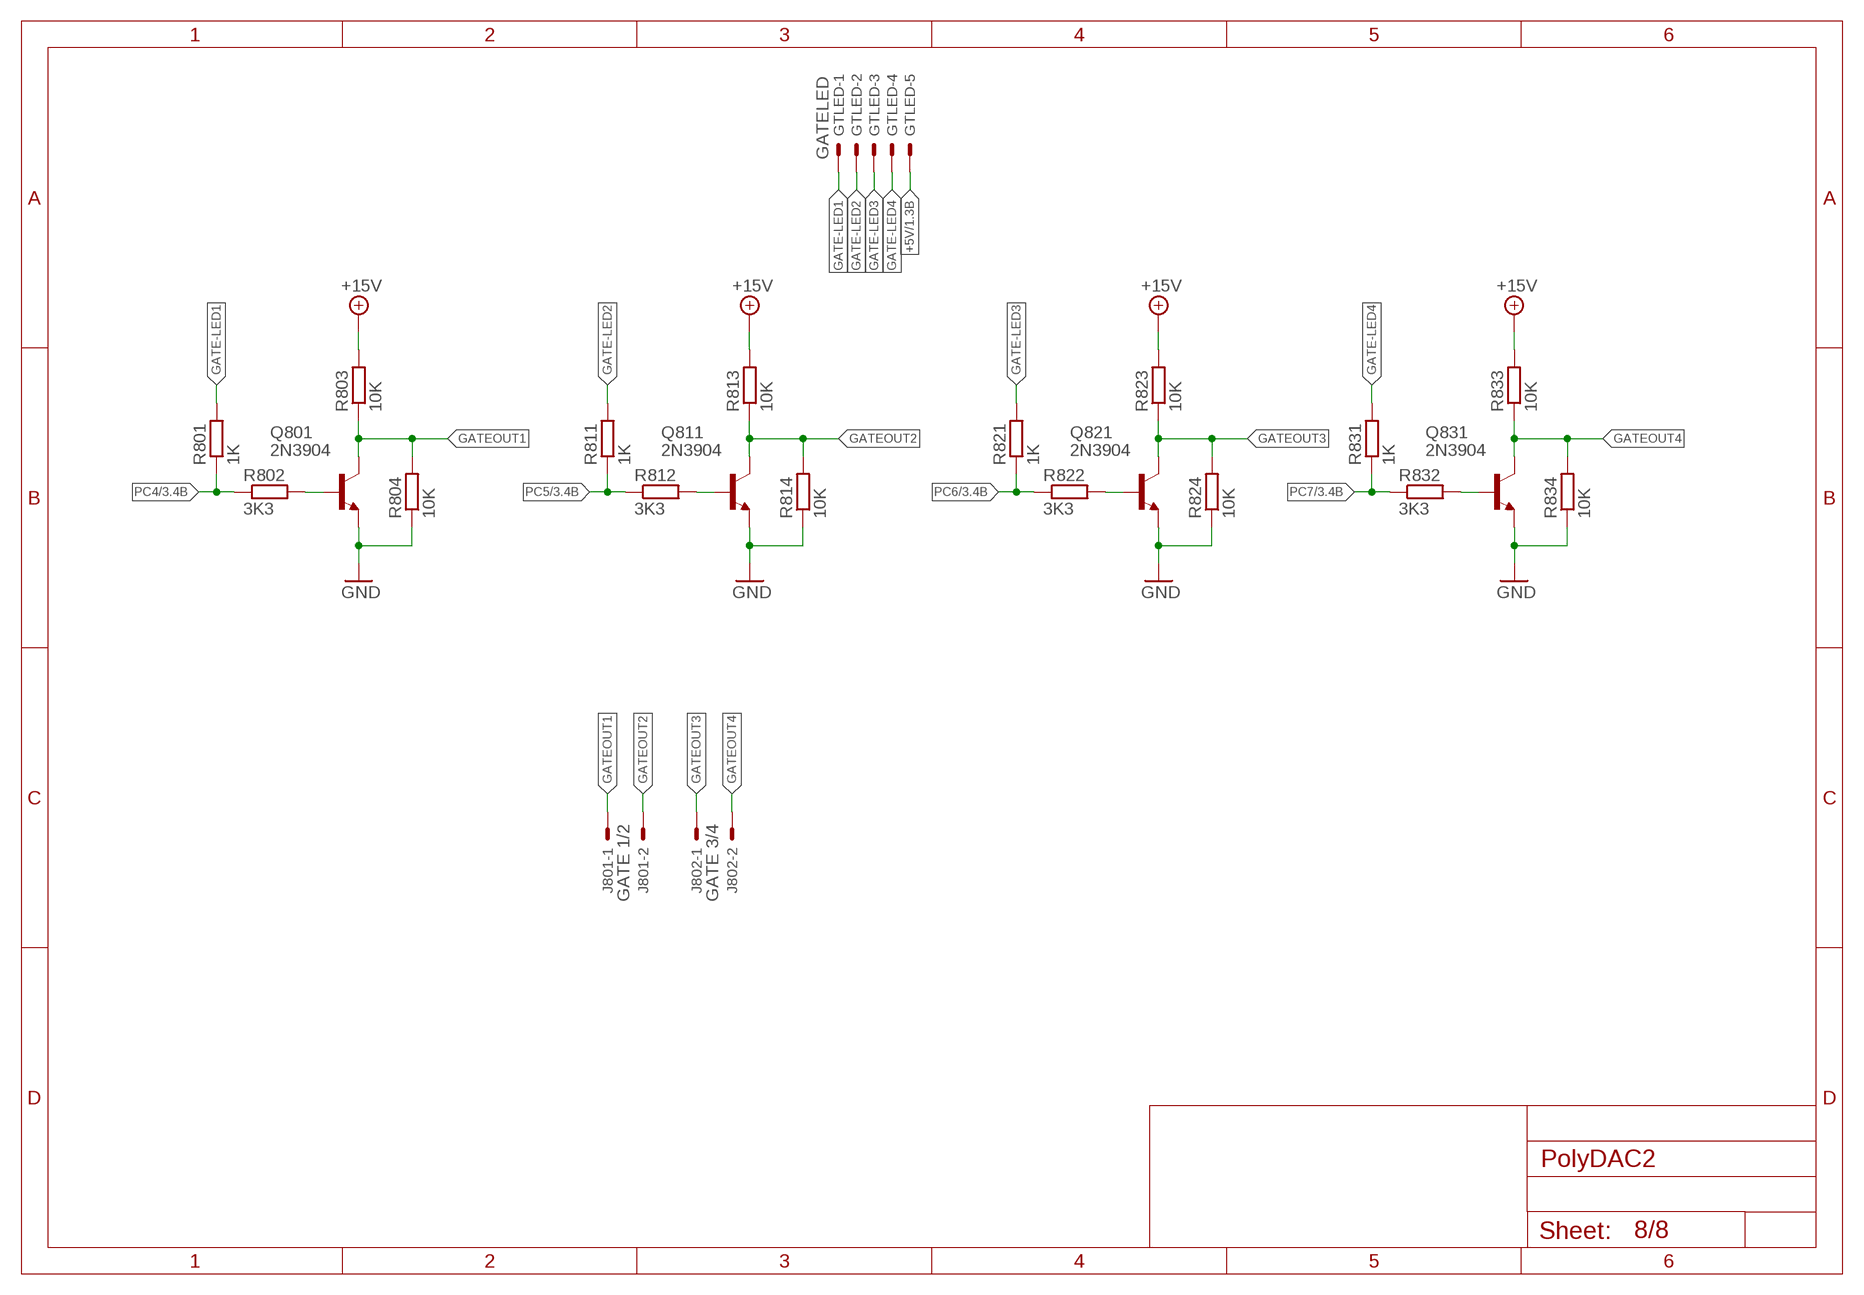
[diagram p7: schematic, sheet 8]

### Parts
GTLED  GATELED  22-23-2051  [22-23-2051]
J801  GATE 1/2  22-23-2021  [22-23-2021]
J802  GATE 3/4  22-23-2021  [22-23-2021]
Q801  2N3904  [TO92]
Q811  2N3904  [TO92]
Q821  2N3904  [TO92]
Q831  2N3904  [TO92]
R801  1K  R-EU_0207/10  [0207/10]
R802  3K3  R-EU_0207/10  [0207/10]
R803  10K  R-EU_0207/10  [0207/10]
R804  10K  R-EU_0207/10  [0207/10]
R811  1K  R-EU_0207/10  [0207/10]
R812  3K3  R-EU_0207/10  [0207/10]
R813  10K  R-EU_0207/10  [0207/10]
R814  10K  R-EU_0207/10  [0207/10]
R821  1K  R-EU_0207/10  [0207/10]
R822  3K3  R-EU_0207/10  [0207/10]
R823  10K  R-EU_0207/10  [0207/10]
R824  10K  R-EU_0207/10  [0207/10]
R831  1K  R-EU_0207/10  [0207/10]
R832  3K3  R-EU_0207/10  [0207/10]
R833  10K  R-EU_0207/10  [0207/10]
R834  10K  R-EU_0207/10  [0207/10]

### Nets
+5V [bold]: GTLED.5 ; also sheet 1,2,3,7
+15V [bold]: R803.2 R813.2 R823.2 R833.2 ; also sheet 1,4,5,6,7
GATE-LED1: GTLED.1 R801.2
GATE-LED2: GTLED.2 R811.2
GATE-LED3: GTLED.3 R821.2
GATE-LED4: GTLED.4 R831.2
GATEOUT1: J801.1 Q801.1(C) R803.1 R804.2
GATEOUT2: J801.2 Q811.1(C) R813.1 R814.2
GATEOUT3: J802.1 Q821.1(C) R823.1 R824.2
GATEOUT4: J802.2 Q831.1(C) R833.1 R834.2
GND [bold]: Q801.3(E) Q811.3(E) Q821.3(E) Q831.3(E) R804.1 R814.1 R824.1 R834.1 ; also sheet 1,2,3,4,5,6,7
N$90: Q801.2(B) R802.2
N$95: Q811.2(B) R812.2
N$99: Q821.2(B) R822.2
N$103: Q831.2(B) R832.2
PC4: R801.1 R802.1 ; also sheet 3
PC5: R811.1 R812.1 ; also sheet 3
PC6: R821.1 R822.1 ; also sheet 3
PC7: R831.1 R832.1 ; also sheet 3

## Library data of the parts
C104-C106 C201 C204-C206 C401-C404 C501 C502 C511 C521 C522 C531 C541-C544 C601 C611 C621 C631 C641-C648 C701-C704 C711-C714 C721-C724 C731-C736 = resistor:C-EU: CAPACITOR, European symbol
C202 C203 C207 = resistor:CPOL-EU: POLARIZED CAPACITOR, European symbol
D101 = diode:1N4148: DIODE high speed (Philips)
D201 = diode:1N4004: DIODE general purpose rectifier, 1 A
D401 = diode:BAT42: DIODE barrier diode
D531 = linear:LM336: 2.5-V INTEGRATED REFERENCE CIRCUITS LM236 Source: http://focus.ti.com/lit/ds/symlink/lm336-2.5.pdf
GTLED J201 S101 S102 = con-molex:22-23-2051: .100" (2.54mm) Center Header - 5 Pin; MF: MOLEX; MPN: 22-23-2051; OC_FARNELL: 1462952; OC_NEWARK: 38C9178
J099 J101 J501 J601 J602 J701 J702 J711 J712 J801 J802 = con-molex:22-23-2021: .100" (2.54mm) Center Header - 2 Pin; MF: MOLEX; MPN: 22-23-2021; OC_FARNELL: 1462926; OC_NEWARK: 25C3832
J102 = con-harting-ml:ML6: HARTING; OC_FARNELL: unknown; OC_NEWARK: unknown
J104 J531 P402 P501 X2 = con-molex:22-23-2031: .100" (2.54mm) Center Header - 3 Pin; MF: MOLEX; MPN: 22-23-2031; OC_FARNELL: 1462950; OC_NEWARK: 30C0862
L201 L202 = resistor:L-US: INDUCTOR, American symbol
P401 P531 = rcl:R-TRIMM: Trimm resistor
Q101 Q801 Q811 Q821 Q831 = transistor-neu-to92:2N3904: NPN TRANSISTOR
Q102 = transistor-neu-to92:*-PNP-: PNP Transistror
R101 R102 R106-R112 R201 R202 R412-R416 R418 R419 R501 R511 R521 R531-R537 R601-R608 R611-R618 R621-R628 R631-R638 R701-R704 R711-R714 R801-R804 R811-R814 R821-R824 R831-R834 = resistor:R-EU_: RESISTOR, European symbol
R113 R115 = resistor-net:RN04: RESISTOR NETWORK; OC_FARNELL: unknown; OC_NEWARK: unknown
R114 = resistor-net:RN05: RESISTOR NETWORK; OC_FARNELL: unknown; OC_NEWARK: unknown
S104 = switch-dil:DP04: DIL/CODE SWITCH; MPN: DP04; OC_FARNELL: 9471600; OC_NEWARK: 73J0027
U101 = optocoupler:6N138: MOTOROLA OPTO COUPLER; MF: VISHAY/TELEFUNKEN; MPN: 6N138; OC_FARNELL: 9860150; OC_NEWARK: 35K5294
U102 = atmel:MEGA16-P: MICROCONTROLLER 16 Kbytes FLASH 1 kbytes SRAM 512 bytes EEPROM USART 8-channel 10 bit ADC Source: avr.lbr; MPN: ATMEGA16-16PU; OC_FARNELL: 9171142; OC_NEWARK: 01M6885
U201 = linear:78*: Positive VOLTAGE REGULATOR Source: http://cache.national.com/ds/LM/LM78L05.pdf http://www.fairchildsemi.com/ds/LM/LM7805.pdf
U401 = ad8300:AD8300: AD8300 +3 VOLT, SERIAL INPUT COMPLETE 12-BIT DAC The AD8300 is a complete 12-bit, voltage-output digital-to-analog converter designed to operate from a single +3 volt supply. Built using a CBCMOS process, this monolithic DAC offers the user low cost, and ease-of-use in single-supply +3 volt systems. Operation is guaranteed over the supply voltage range of +2.7 V to +5.5 V making this device ideal for battery operated applications. The 2.0475 V full-scale voltage output is laser trimmed to maintain accuracy over the operating temperature range of the device. The binary input data format provides an easy-to-use one-half-millivolt-per-bit software programmability. The voltage outputs are capable of sourcing 5 mA. A double buffered serial data interface offers high speed, three-wire, DSP and microcontroller compatible inputs using data in (SDI), clock (CLK) and load strobe (LD) pins. A chip select (CS) pin simplifies connection of multiple DAC packages by enabling the clock input when active low. Additionally, a CLR input sets the output to zero scale at power on or upon user demand. The AD8300 is specified over the extended industrial (-40°C to +85°C) temperature range. AD8300's are available in plastic DIP, and low profile 1.5 mm height SO-8 surface mount packages.
U402 = linear:AD712: OP AMP
U403 = 40xx:4067: 16-channel ANALOG MULTIPLEXER
U404 = 45xx:4504: TTL or CMOS to CMOS hex LEVEL SHIFTER
U501 U701 U711 U721 = linear:TL074: OP AMP
U531 U601 U611 U621 U631 = linear:LF412: OP AMP
X101 = crystal:XO-: CRYSTAL; OC_FARNELL: unknown; OC_NEWARK: unknown

## Net classes
1 bold: width 0.508 mm